# EAGLE design gp5 (EAGLE 9.6.2)

## Sheet 1 of 2: Voltage regulator
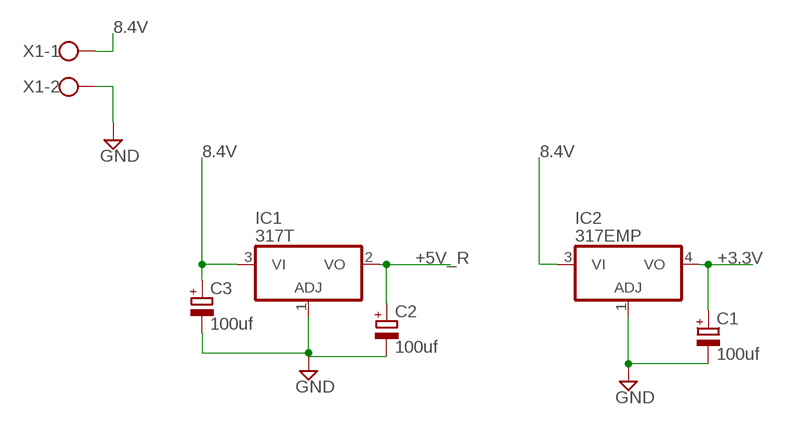
[diagram p0: schematic, sheet 1]

### Parts
C1  100uf  CPOL-EUB45181B  [B45181B]
C2  100uf  CPOL-EUB45181B  [B45181B]
C3  100uf  CPOL-EUB45181B  [B45181B]
IC1  317T  [TO220H]
IC2  317EMP  [SOT223]
X1  W237-102  [W237-102]

### Nets
8.4V: C3.+ IC1.3(VI) IC2.3(VI) X1.1
+3.3V: C1.+ IC2.4(VO) ; also sheet 2
+5V_R: C2.+ IC1.2(VO) ; also sheet 2
GND: C1.- C2.- C3.- IC1.1(ADJ) IC2.1(ADJ) X1.2 ; also sheet 2

## Sheet 2 of 2
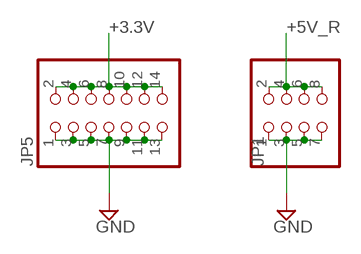
[diagram p1: schematic, sheet 2]

### Parts
JP1  PINHD-2X4  [2X04]
JP5  PINHD-2X7  [2X07]

### Nets
+3.3V: JP5.2 JP5.4 JP5.6 JP5.8 JP5.10 JP5.12 JP5.14 ; also sheet 1
+5V_R: JP1.2 JP1.4 JP1.6 JP1.8 ; also sheet 1
GND: JP1.1 JP1.3 JP1.5 JP1.7 JP5.1 JP5.3 JP5.5 JP5.7 JP5.9 JP5.11 JP5.13 ; also sheet 1

## Library data of the parts
C1-C3 = rcl:CPOL-EU: POLARIZED CAPACITOR, European symbol; SPICEPREFIX: C
IC1 IC2 = linear:*317: Positive VOLTAGE REGULATOR
JP1 = pinhead:PINHD-2X4: PIN HEADER
JP5 = pinhead:PINHD-2X7: PIN HEADER
X1 = con-wago-500:W237-102: WAGO SCREW CLAMP; MPN: 237-102; OC_FARNELL: unknown; OC_NEWARK: 70K9898

## Board
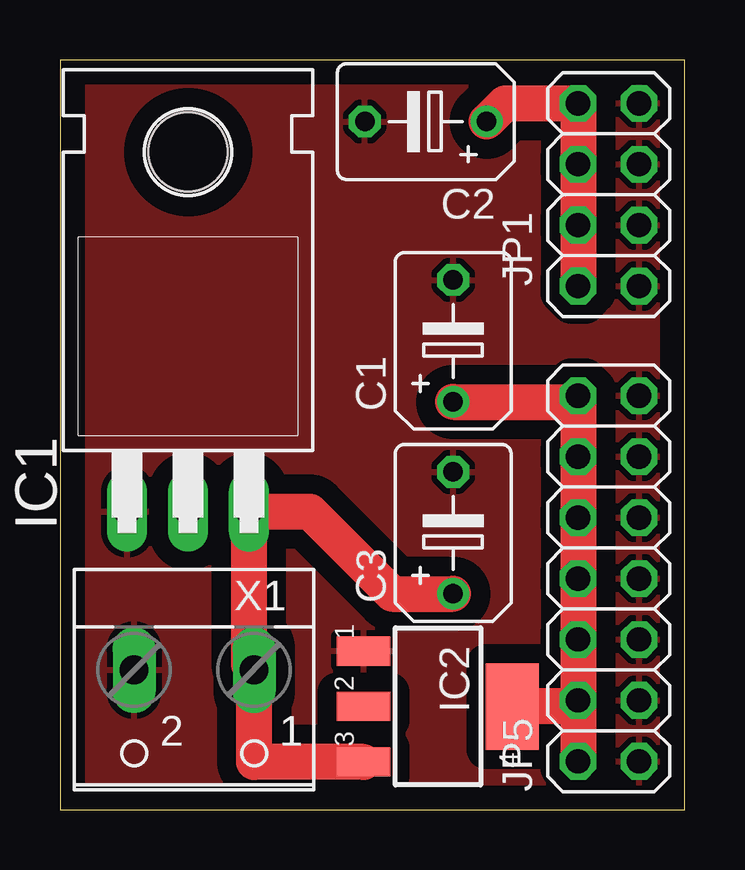
[diagram p2: board, top side]
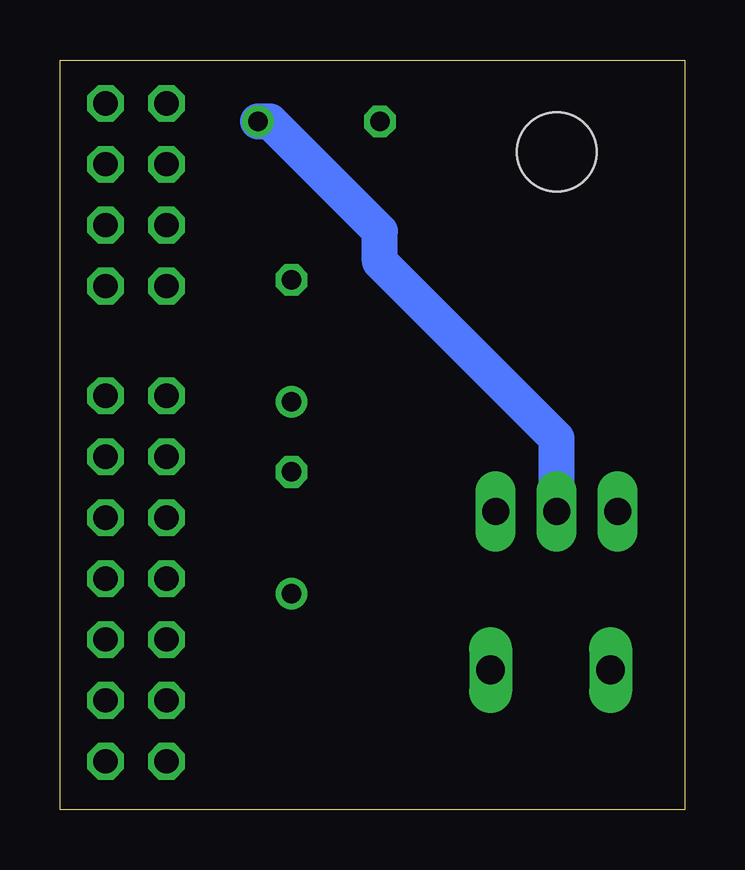
[diagram p3: board, bottom side, seen from below]

Size 26.03 x 31.27 mm. Coordinates in mm from the lower left corner, seen from the top.
Outline: 0,0 26.03,0 26.03,31.27 0,31.27 0,0
Copper layers (1*16): Top 0.035mm / dielectric 1.5mm / Bottom 0.035mm
Design rules "default *": minimum track width 1mm, minimum drill 0.8mm, track to track 0.8mm, track to pad 0.8mm, pad to pad 0.8mm, via to via 0.8mm, smd to smd 8mil, copper to edge 40mil, drill to drill 6mil, minimum pad ring 10mil, minimum via ring 8mil, stop-mask expansion 4mil, vias tented up to drill 0mil, thermal gap 10mil

### Footprints (pad centres in the part's own frame; a part is rotated, then mirrored left to right if it is on the bottom)
B45181B = drill 0.813: + -2.54,0 | drill 0.813 octagon: - 2.54,0
TO220H = drill 1.118 long: 1 -2.54,-10.16; 2 0,-10.16; 3 2.54,-10.16 | hole 3.302: 0,4.826
SOT223 = smd 1.219 x 2.235: 1 -2.311,-3.099; 2 0,-3.099; 3 2.311,-3.099 | smd 3.6 x 2.2: 4 0,3.099
2X04 = drill 1.016 octagon: 1 -3.81,-1.27; 2 -3.81,1.27; 3 -1.27,-1.27; 4 -1.27,1.27; 5 1.27,-1.27; 6 1.27,1.27; 7 3.81,-1.27; 8 3.81,1.27
2X07 = drill 1.016 octagon: 1 -7.62,-1.27; 2 -7.62,1.27; 3 -5.08,-1.27; 4 -5.08,1.27; 5 -2.54,-1.27; 6 -2.54,1.27; 7 0,-1.27; 8 0,1.27; 9 2.54,-1.27; 10 2.54,1.27; 11 5.08,-1.27; 12 5.08,1.27; 13 7.62,-1.27; 14 7.62,1.27
W237-102 = drill 1.194 long: 1 -2.5,-1.27; 2 2.5,-1.27

### Placement (x,y rotation side)
C1  16.38,19.56 90 top
C2  15.24,28.7 180 top
C3  16.38,11.56 90 top
IC1  5.33,22.61 0 top
IC2  15.75,4.32 270 top
JP1  22.86,25.65 90 top
JP5  22.86,9.65 90 top
X1  5.59,4.57 180 top

### Tracks (layer width: path | path; a pad name or v marks a point on that pad's centre or on a via)
8.4V
  Top 1.5: C3.+ 13.84,9.02 10.41,12.45 IC1.3 7.87,6.06 X1.1 8.09,2.01 IC2.3
+3.3V
  Top 1.5: C1.+ 21.34,17.02 JP5.14 JP5.12 JP5.10 JP5.8 JP5.6 JP5.4 | JP5.4 JP5.2 | JP5.4 21.34,4.32 IC2.4
+5V_R
  Top 1.5: C2.+ 18.54,29.46 JP1.8 JP1.6 JP1.4 JP1.2
  Bottom 1.5: IC1.2 5.33,15.49 12.7,22.86 12.7,24.13 17.27,28.7 C2.+
GND
  pour Top: 0,31.24 0,0 26.04,0 26.04,31.24